# Altium schematic sheet Control Loop Top.SchDoc
size 406 x 304 mm; SheetNumber: 2; SheetTotal: 14
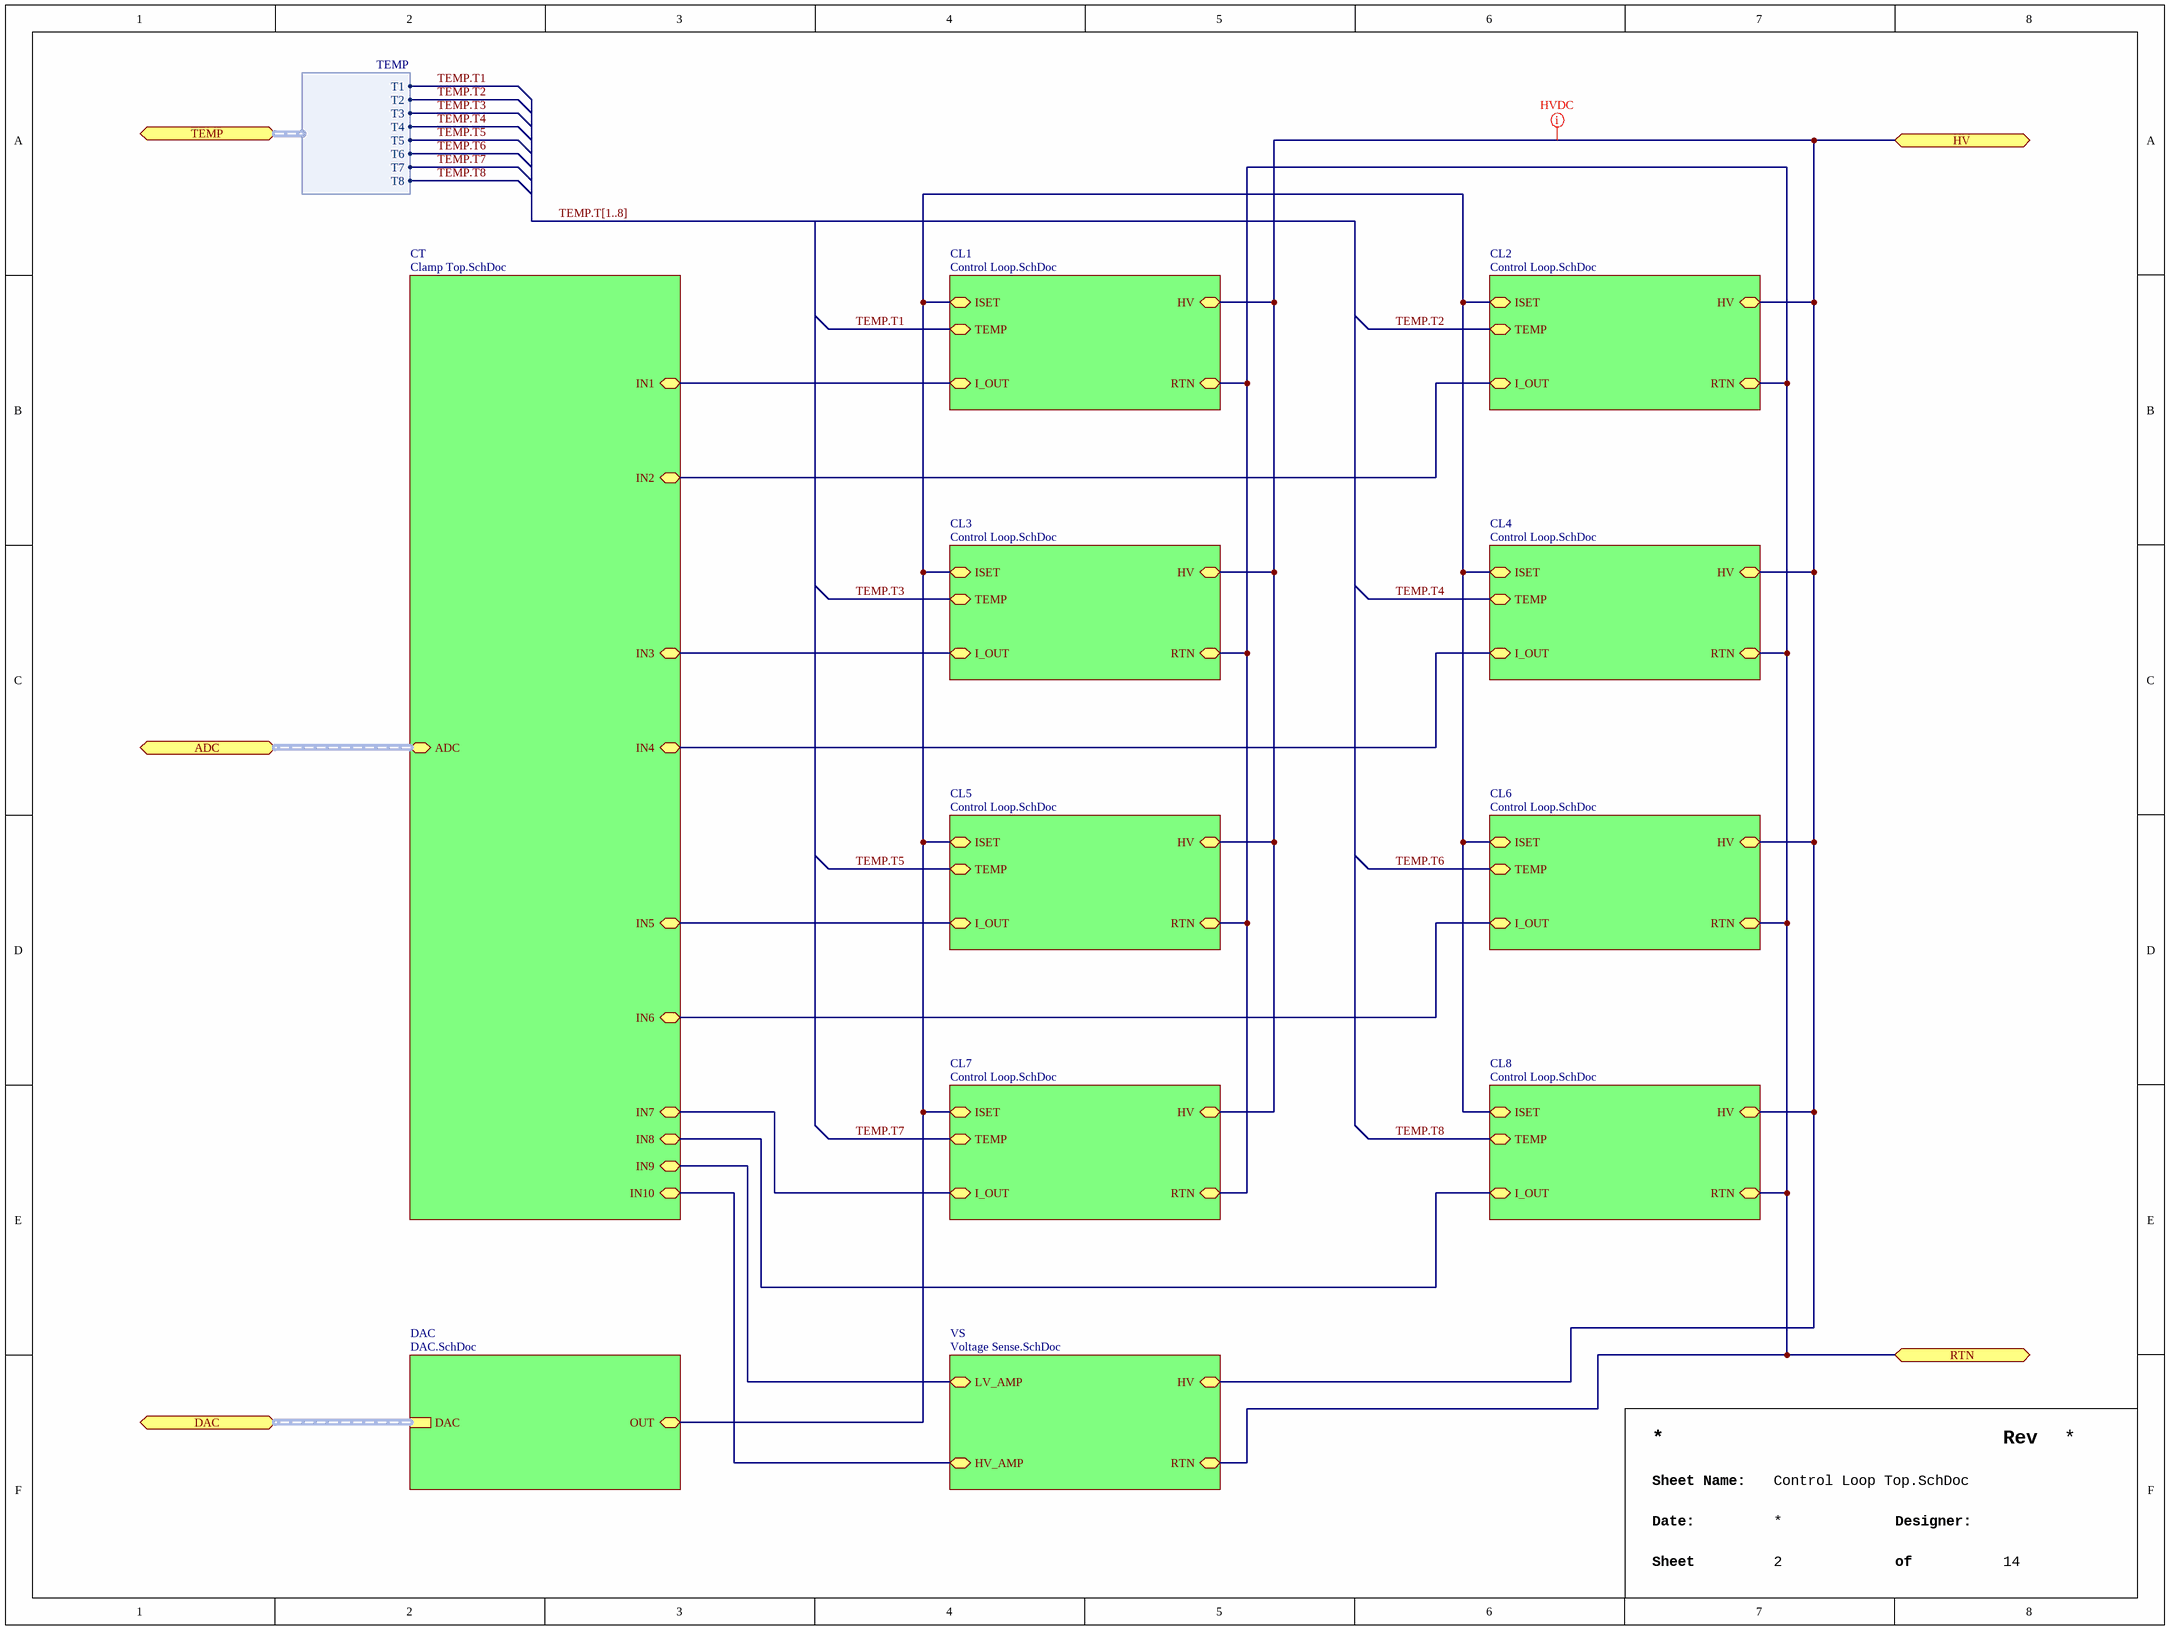
[diagram p0: Control Loop Top.SchDoc]

## Sub-sheets
CL1 = Control Loop.SchDoc: HV (bidir), RTN (bidir), ISET (bidir), TEMP (bidir), I_OUT (bidir)
CL2 = Control Loop.SchDoc: HV (bidir), RTN (bidir), ISET (bidir), TEMP (bidir), I_OUT (bidir)
CL3 = Control Loop.SchDoc: HV (bidir), RTN (bidir), ISET (bidir), TEMP (bidir), I_OUT (bidir)
CL4 = Control Loop.SchDoc: HV (bidir), RTN (bidir), ISET (bidir), TEMP (bidir), I_OUT (bidir)
CL5 = Control Loop.SchDoc: HV (bidir), RTN (bidir), ISET (bidir), TEMP (bidir), I_OUT (bidir)
CL6 = Control Loop.SchDoc: HV (bidir), RTN (bidir), ISET (bidir), TEMP (bidir), I_OUT (bidir)
CL7 = Control Loop.SchDoc: HV (bidir), RTN (bidir), ISET (bidir), TEMP (bidir), I_OUT (bidir)
CL8 = Control Loop.SchDoc: HV (bidir), RTN (bidir), ISET (bidir), TEMP (bidir), I_OUT (bidir)
CT = Clamp Top.SchDoc: IN10 (bidir), IN1 (bidir), IN2 (bidir), IN3 (bidir), IN4 (bidir), IN5 (bidir), IN6 (bidir), IN7 (bidir), IN8 (bidir), IN9 (bidir), ADC (bidir, harness ADC)
DAC = DAC.SchDoc: DAC (harness DAC), OUT (bidir)
VS = Voltage Sense.SchDoc: RTN (bidir), HV (bidir), LV_AMP (bidir), HV_AMP (bidir)

## Ports
ADC (bidir, harness ADC), DAC (bidir, harness DAC), HV (bidir), RTN (bidir), TEMP (bidir, harness TEMP)

## Harnesses
TEMP: T1, T2, T3, T4, T5, T6, T7, T8

## Nets
HV: port HV, sheet CL1/HV, sheet CL2/HV, sheet CL3/HV, sheet CL5/HV, sheet CL6/HV, sheet CL4/HV, sheet VS/HV, sheet CL7/HV, sheet CL8/HV
RTN: port RTN, sheet CL1/RTN, sheet CL2/RTN, sheet CL3/RTN, sheet CL5/RTN, sheet CL6/RTN, sheet CL4/RTN, sheet VS/RTN, sheet CL7/RTN, sheet CL8/RTN
TEMP.T1: sheet CL1/TEMP, port TEMP.T1
TEMP.T2: sheet CL2/TEMP, port TEMP.T2
TEMP.T3: sheet CL3/TEMP, port TEMP.T3
TEMP.T4: sheet CL4/TEMP, port TEMP.T4
TEMP.T5: sheet CL5/TEMP, port TEMP.T5
TEMP.T6: sheet CL6/TEMP, port TEMP.T6
TEMP.T7: sheet CL7/TEMP, port TEMP.T7
TEMP.T8: sheet CL8/TEMP, port TEMP.T8
(unnamed): sheet CL1/ISET, sheet DAC/OUT, sheet CL2/ISET, sheet CL3/ISET, sheet CL5/ISET, sheet CL6/ISET, sheet CL4/ISET, sheet CL7/ISET, sheet CL8/ISET
(unnamed): sheet CL1/I_OUT, sheet CT/IN1
(unnamed): sheet CL2/I_OUT, sheet CT/IN2
(unnamed): sheet CL3/I_OUT, sheet CT/IN3
(unnamed): sheet CL5/I_OUT, sheet CT/IN5
(unnamed): sheet CL6/I_OUT, sheet CT/IN6
(unnamed): sheet CL4/I_OUT, sheet CT/IN4
(unnamed): sheet VS/LV_AMP, sheet CT/IN9
(unnamed): sheet VS/HV_AMP, sheet CT/IN10
(unnamed): sheet CL7/I_OUT, sheet CT/IN7
(unnamed): sheet CL8/I_OUT, sheet CT/IN8

## Buses and harness runs
bus TEMP.T[1..8]
harness port ADC = sheet CT/ADC
harness port DAC = sheet DAC/DAC

## Layout directives
net class HVDC: HV

## Notes on the sheet
- Rev
- Sheet Name:
- Date:
- Sheet
- Designer:
- of